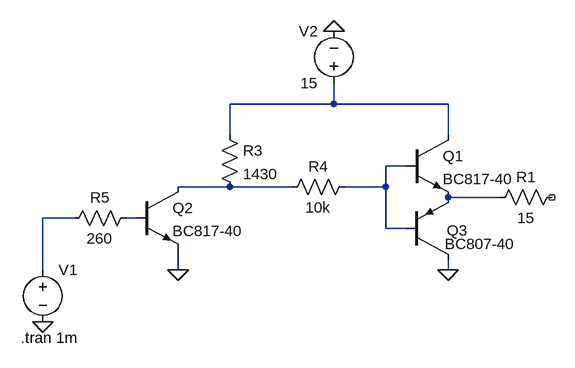
[diagram p0: schematic PG_testing_trans.asc]
PG_testing_trans.asc, the LTspice schematic file:
Version 4
SHEET 1 880 680
WIRE -48 -32 -48 -64
WIRE -48 -32 -208 -32
WIRE 128 -32 -48 -32
WIRE -208 16 -208 -32
WIRE 128 16 128 -32
WIRE 64 64 32 64
WIRE -208 96 -288 96
WIRE -112 96 -208 96
WIRE 32 96 32 64
WIRE 32 96 -32 96
WIRE 208 112 128 112
WIRE -448 144 -496 144
WIRE -352 144 -368 144
WIRE 32 160 32 96
WIRE 64 160 32 160
WIRE -496 224 -496 144
WIRE -288 224 -288 192
WIRE 128 224 128 208
FLAG -496 304 0
FLAG -288 224 0
FLAG 128 224 0
FLAG -48 -144 0
SYMBOL voltage -496 208 R0
WINDOW 123 0 0 Left 0
WINDOW 39 0 0 Left 0
WINDOW 3 24 96 Invisible 2
SYMATTR Value PULSE(0 3.3 100n 100n 0 10u 20u)
SYMATTR InstName V1
SYMBOL npn 64 16 R0
SYMATTR InstName Q1
SYMATTR Value BC817-40
SYMBOL npn -352 96 R0
SYMATTR InstName Q2
SYMATTR Value BC817-40
SYMBOL res 304 96 R90
WINDOW 0 0 56 VBottom 2
WINDOW 3 32 56 VTop 2
SYMATTR InstName R1
SYMATTR Value 15
SYMBOL res -224 0 R0
SYMATTR InstName R3
SYMATTR Value 1430
SYMBOL pnp 64 208 M180
WINDOW 0 62 45 Left 2
WINDOW 3 59 24 Left 2
SYMATTR InstName Q3
SYMATTR Value BC807-40
SYMBOL res -16 80 R90
WINDOW 0 0 56 VBottom 2
WINDOW 3 32 56 VTop 2
SYMATTR InstName R4
SYMATTR Value 10k
SYMBOL res -352 128 R90
WINDOW 0 0 56 VBottom 2
WINDOW 3 32 56 VTop 2
SYMATTR InstName R5
SYMATTR Value 260
SYMBOL voltage -48 -48 R180
WINDOW 0 24 96 Left 2
WINDOW 3 24 16 Left 2
WINDOW 123 0 0 Left 0
WINDOW 39 0 0 Left 0
SYMATTR InstName V2
SYMATTR Value 15
TEXT -530 328 Left 2 !.tran 1m

The netlist it stands for:
* PG_testing_trans.asc
V1 N005 0 PULSE(0 3.3 100n 100n 0 10u 20u)
Q1 N001 N002 N004 0 BC817-40
Q2 N003 N006 0 0 BC817-40
R1 NC_01 N004 15
R3 N001 N003 1430
Q3 0 N002 N004 0 BC807-40
R4 N002 N003 10k
R5 N006 N005 260
V2 N001 0 15
.model NPN NPN
.model PNP PNP
.lib standard.bjt
.tran 1m
.backanno
.end